# EAGLE design sword (EAGLE 8.0.0)
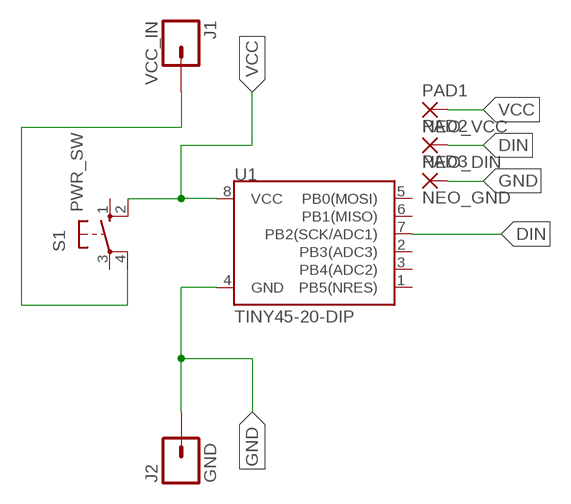
[diagram p0: schematic, sheet 1]

## Parts
J1  VCC_IN  M01PTH_LONGPAD  [1X01_LONGPAD]
J2  GND  M01PTH_LONGPAD  [1X01_LONGPAD]
PAD1  NEO_VCC  SMD2  [SMD1,27-2,54]
PAD2  NEO_DIN  SMD2  [SMD1,27-2,54]
PAD3  NEO_GND  SMD2  [SMD1,27-2,54]
S1  PWR_SW  10-XX  [B3F-10XX]
U1  TINY45-20-DIP  ATTINY45TINY45-20-DIP  [DIP08]

## Nets
DIN: PAD2.1(P) U1.7(PB2(SCK/ADC1))
GND: J2.1 PAD3.1(P) U1.4(GND)
VCC: PAD1.1(P) S1.2(S1) U1.8(VCC)
VCC_SW: J1.1 S1.4(P1)
Unconnected: S1.1(S) S1.3(P) U1.1(PB5(NRES)) U1.2(PB3(ADC3)) U1.3(PB4(ADC2)) U1.5(PB0(MOSI)) U1.6(PB1(MISO))

## Library data of the parts
J1 J2 = SparkFun-Connectors:M01: Header 1 Standard 1-pin 0.1" header. Use with straight break away headers (SKU : PRT-00116), right angle break away headers (PRT-00553), swiss pins (PRT-00743), machine pins (PRT-00117), and female headers (PRT-00115). SMTSO-256-ET is a "flush mount" nut for a 4-40 screw. The older package used to be too tight, and did not allow it to sit properly thru the drill hit. The latest (0.165DIA) fits nice and snug.
PAD1-PAD3 = wirepad:SMD2: SMD PAD
S1 = switch-omron:10-XX: OMRON SWITCH; MPN: B3F-1000; OC_FARNELL: 176432; OC_NEWARK: 36M3542
U1 = SparkFun-DigitalIC:ATTINY45: Atmel 8-pin 2/4/8kB flash uC; PROD_ID: IC-09439

## Board
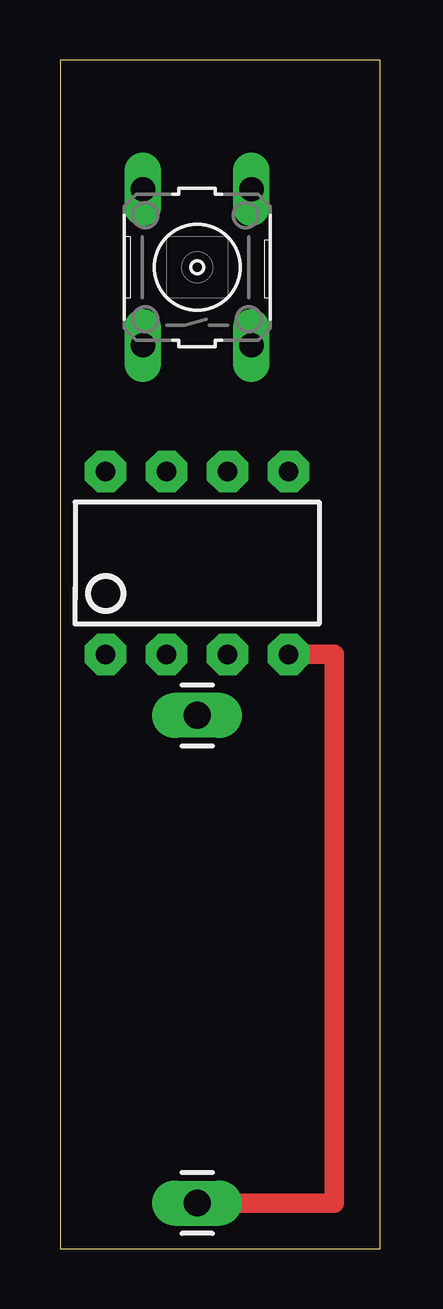
[diagram p1: board, top side]
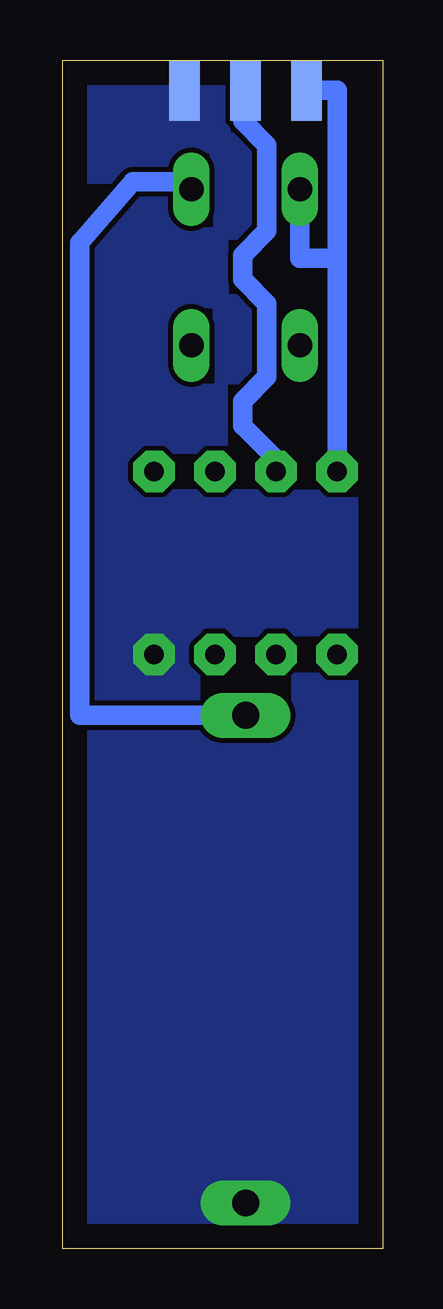
[diagram p2: board, bottom side, seen from below]

Size 13.34 x 49.53 mm. Coordinates in mm from the lower left corner, seen from the top.
Outline: 0,0 13.34,0 13.34,49.53 0,49.53 0,0
Copper layers (1*16): Top 0.035mm / dielectric 1.5mm / Bottom 0.035mm
Design rules "default *": minimum track width 32mil, minimum drill 24mil, track to track 8mil, track to pad 8mil, pad to pad 8mil, via to via 8mil, smd to smd 8mil, copper to edge 40mil, drill to drill 8mil, minimum pad ring 10mil, minimum via ring 8mil, stop-mask expansion 4mil, vias tented up to drill 0mil, thermal gap 10mil

### Footprints (pad centres in the part's own frame; a part is rotated, then mirrored left to right if it is on the bottom)
1X01_LONGPAD = drill 1.118 pad 1.88 long: 1 0,0
SMD1,27-2,54 = smd 1.27 x 2.54: 1 0,0
B3F-10XX = drill 1.016 long: 1 -3.251,2.261; 2 3.251,2.261; 3 -3.251,-2.261; 4 3.251,-2.261
DIP08 = drill 0.813 pad 1.727 octagon: 1 -3.81,-3.81; 2 -1.27,-3.81; 3 1.27,-3.81; 4 3.81,-3.81; 5 3.81,3.81; 6 1.27,3.81; 7 -1.27,3.81; 8 -3.81,3.81

### Placement (x,y rotation side)
J1  5.71,22.23 90 top
J2  5.71,1.91 270 top
PAD1  3.17,48.26 0 bottom
PAD2  5.71,48.26 0 bottom
PAD3  8.26,48.26 0 bottom
S1  5.71,40.89 90 top
U1  5.71,28.57 0 top

### Tracks (layer width: path | path; a pad name or v marks a point on that pad's centre or on a via)
DIN
  Bottom 0.813: PAD2.1 5.84,48.01 5.84,46.99 4.83,45.97 4.83,42.42 5.84,41.4 5.84,40.39 4.83,39.37 4.83,36.32 5.84,35.31 5.84,34.29 4.32,32.77 U1.7
GND
  Top 0.813: J2.1 11.43,1.91 11.43,24.77 U1.4
  pour Bottom (no thermals): -2.54,52.07 26.67,52.07 26.67,-2.54 -2.54,-2.54
VCC
  Bottom 0.813: U1.8 1.91,41.27 | 1.91,41.27 1.91,48.26 PAD1.1 | S1.2 3.45,41.27 1.91,41.27
VCC_SW
  Bottom 0.813: S1.4 8.38,44.45 10.41,44.45 12.64,41.91 12.64,22.23 J1.1